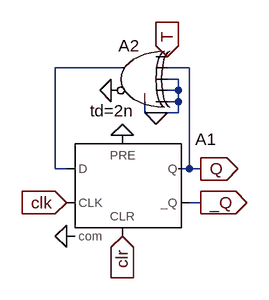
[diagram p0: schematic Tflipflop.asc]
Tflipflop.asc, the LTspice schematic file:
Version 4
SHEET 1 1396 984
WIRE 592 224 496 224
WIRE 688 224 656 224
WIRE 672 240 656 240
WIRE 672 256 672 240
WIRE 672 256 656 256
WIRE 672 272 672 256
WIRE 672 272 656 272
WIRE 624 288 624 272
WIRE 640 288 624 288
WIRE 672 288 672 272
WIRE 672 288 640 288
WIRE 496 368 496 224
WIRE 512 368 496 368
WIRE 688 368 688 224
WIRE 688 368 672 368
WIRE 704 368 688 368
WIRE 704 416 688 416
FLAG 704 368 Q
IOPIN 704 368 Out
FLAG 704 416 _Q
IOPIN 704 416 Out
FLAG 592 464 clr
IOPIN 592 464 In
FLAG 656 208 T
IOPIN 656 208 In
FLAG 512 416 clk
IOPIN 512 416 In
FLAG 592 320 0
FLAG 640 288 0
FLAG 576 256 0
FLAG 512 464 0
SYMBOL Digital\\dflop 592 320 R0
SYMATTR InstName A1
SYMBOL Digital\\xor 608 176 M0
WINDOW 3 1 109 Left 2
SYMATTR Value td=2n
SYMATTR InstName A2

The netlist it stands for:
* Tflipflop.asc
A1 N001 0 clk 0 clr _Q Q 0 DFLOP
A2 T Q 0 0 0 0 N001 0 XOR td=2n
.backanno
.end